# Altium schematic sheet Boris_IO_5.SchDoc: Boris IO
size A4; Date: 2017.12.10; DrawnBy: Miklós Árpád; Revision: 1.0; SheetNumber: 5; SheetTotal: 5; PageSetup: Record=PageOptions|CenterHorizontal=True|CenterVertical=True|PrintScale=1.00|XCorrection=1.00|YCorrection=1.00|PrintKind=0|BorderSize=5000000|LeftOffset=0|BottomOffset=0|Orientation=2|PaperLength=1000|PaperWidth=1000|Scale=100|PaperSource=7|PrintQuality=-4|MediaType=1|DitherType=10|PaperKind=A4|PrintScaleMode=0
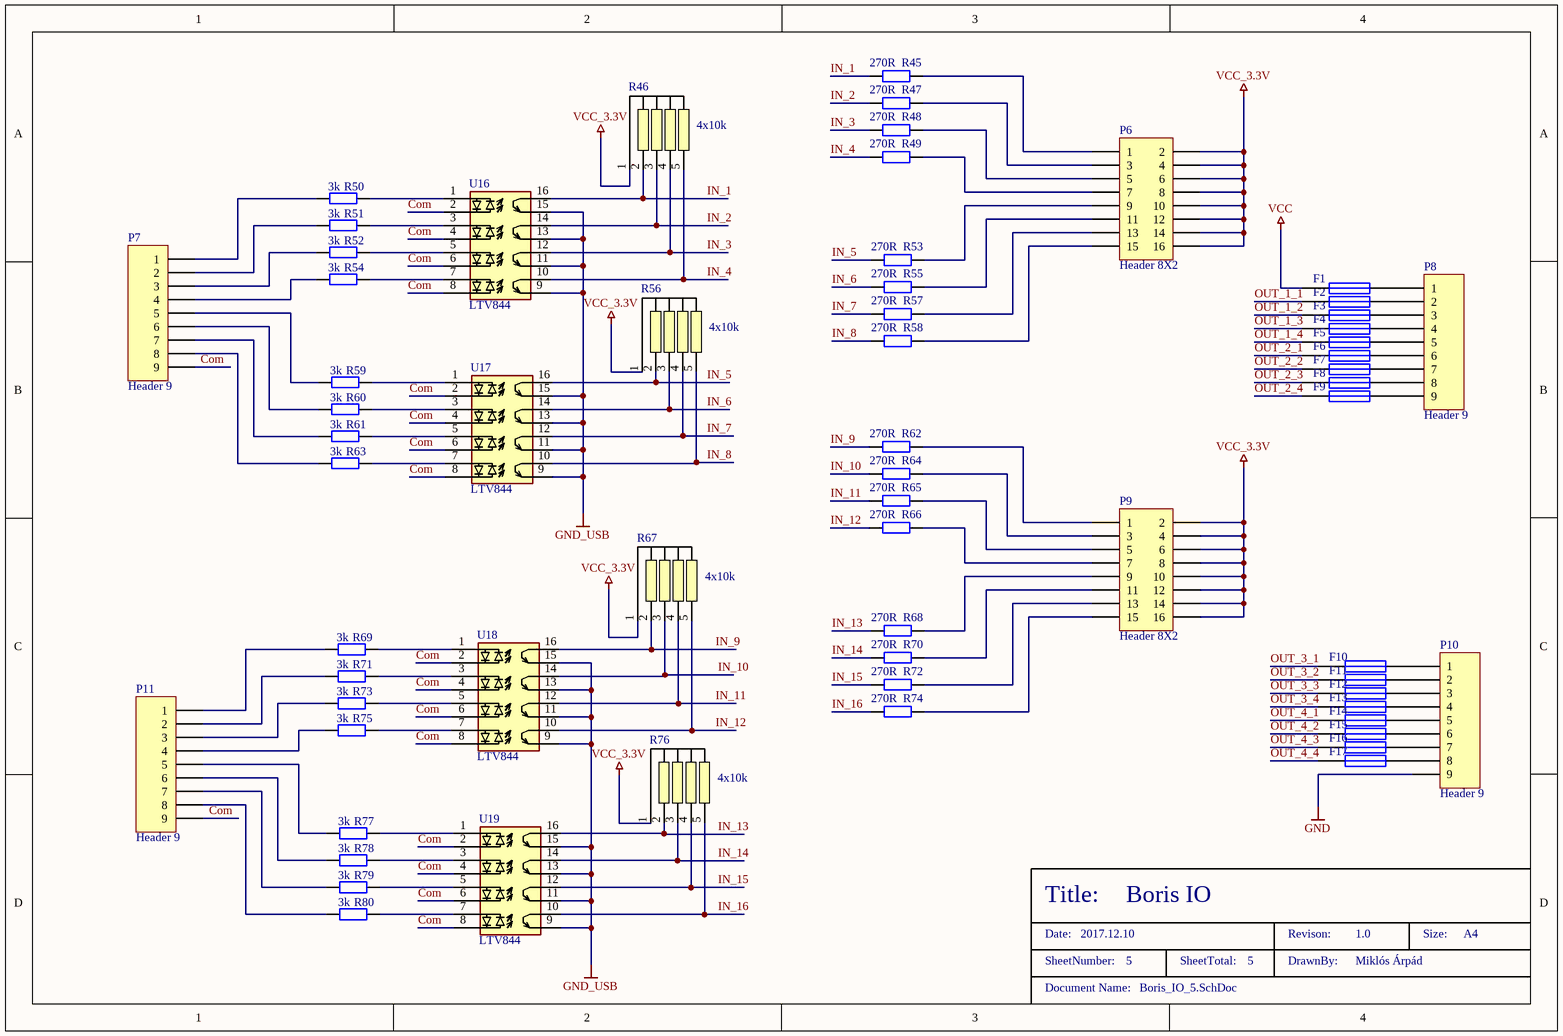
[diagram p0: Boris_IO_5.SchDoc]

## Parts
F1  SSQ 0.25A  [SST6032]  (value not drawn)
F2  SSQ 0.25A  [SST6032]  (value not drawn)
F3  SSQ 0.25A  [SST6032]  (value not drawn)
F4  SSQ 0.25A  [SST6032]  (value not drawn)
F5  SSQ 0.25A  [SST6032]  (value not drawn)
F6  SSQ 0.25A  [SST6032]  (value not drawn)
F7  SSQ 0.25A  [SST6032]  (value not drawn)
F8  SSQ 0.25A  [SST6032]  (value not drawn)
F9  SSQ 0.25A  [SST6032]  (value not drawn)
F10  SSQ 0.25A  [SST6032]  (value not drawn)
F11  SSQ 0.25A  [SST6032]  (value not drawn)
F12  SSQ 0.25A  [SST6032]  (value not drawn)
F13  SSQ 0.25A  [SST6032]  (value not drawn)
F14  SSQ 0.25A  [SST6032]  (value not drawn)
F15  SSQ 0.25A  [SST6032]  (value not drawn)
F16  SSQ 0.25A  [SST6032]  (value not drawn)
F17  SSQ 0.25A  [SST6032]  (value not drawn)
P6  Header 8X2  [HDR2X8]
P7  Header 9  [3x3]
P8  Header 9  [3x3]
P9  Header 8X2  [HDR2X8]
P10  Header 9  [3x3]
P11  Header 9  [3x3]
R45  270R  [0805_RES]
R46  4x10k  [NFD_SIL-RES-5]
R47  270R  [0805_RES]
R48  270R  [0805_RES]
R49  270R  [0805_RES]
R50  3k  [RESC3216N]
R51  3k  [RESC3216N]
R52  3k  [RESC3216N]
R53  270R  [0805_RES]
R54  3k  [RESC3216N]
R55  270R  [0805_RES]
R56  4x10k  [NFD_SIL-RES-5]
R57  270R  [0805_RES]
R58  270R  [0805_RES]
R59  3k  [RESC3216N]
R60  3k  [RESC3216N]
R61  3k  [RESC3216N]
R62  270R  [0805_RES]
R63  3k  [RESC3216N]
R64  270R  [0805_RES]
R65  270R  [0805_RES]
R66  270R  [0805_RES]
R67  4x10k  [NFD_SIL-RES-5]
R68  270R  [0805_RES]
R69  3k  [RESC3216N]
R70  270R  [0805_RES]
R71  3k  [RESC3216N]
R72  270R  [0805_RES]
R73  3k  [RESC3216N]
R74  270R  [0805_RES]
R75  3k  [RESC3216N]
R76  4x10k  [NFD_SIL-RES-5]
R77  3k  [RESC3216N]
R78  3k  [RESC3216N]
R79  3k  [RESC3216N]
R80  3k  [RESC3216N]
U16  LTV844  [LTV844S]
U17  LTV844  [LTV844S]
U18  LTV844  [LTV844S]
U19  LTV844  [LTV844S]

## Nets
GND: P10.9
GND_USB: U16.9 U16.11 U16.13 U16.15 U17.9 U17.11 U17.13 U17.15 U18.9 U18.11 U18.13 U18.15 U19.9 U19.11 U19.13 U19.15
VCC: F1.1
VCC_3.3V: P6.2 P6.4 P6.6 P6.8 P6.10 P6.12 P6.14 P6.16 P9.2 P9.4 P9.6 P9.8 P9.10 P9.12 P9.14 P9.16 R46.1 R56.1 R67.1 R76.1
Com: P7.9 P11.9 U16.2 U16.4 U16.6 U16.8 U17.2 U17.4 U17.6 U17.8 U18.2 U18.4 U18.6 U18.8 U19.2 U19.4 U19.6 U19.8
IN_1: R45.1 R46.2 U16.16
IN_2: R46.3 R47.1 U16.14
IN_3: R46.4 R48.1 U16.12
IN_4: R46.5 R49.1 U16.10
IN_5: R53.1 R56.2 U17.16
IN_6: R55.1 R56.3 U17.14
IN_7: R56.4 R57.1 U17.12
IN_8: R56.5 R58.1 U17.10
IN_9: R62.1 R67.2 U18.16
IN_10: R64.1 R67.3 U18.14
IN_11: R65.1 R67.4 U18.12
IN_12: R66.1 R67.5 U18.10
IN_13: R68.1 R76.2 U19.16
IN_14: R70.1 R76.3 U19.14
IN_15: R72.1 R76.4 U19.12
IN_16: R74.1 R76.5 U19.10
OUT_1_1: F2.1
OUT_1_2: F3.1
OUT_1_3: F4.1
OUT_1_4: F5.1
OUT_2_1: F6.1
OUT_2_2: F7.1
OUT_2_3: F8.1
OUT_2_4: F9.1
OUT_3_1: F10.1
OUT_3_2: F11.1
OUT_3_3: F12.1
OUT_3_4: F13.1
OUT_4_1: F14.1
OUT_4_2: F15.1
OUT_4_3: F16.1
OUT_4_4: F17.1
NetF1_2: F1.2 P8.1
NetF2_2: F2.2 P8.2
NetF3_2: F3.2 P8.3
NetF4_2: F4.2 P8.4
NetF5_2: F5.2 P8.5
NetF6_2: F6.2 P8.6
NetF7_2: F7.2 P8.7
NetF8_2: F8.2 P8.8
NetF9_2: F9.2 P8.9
NetF10_2: F10.2 P10.1
NetF11_2: F11.2 P10.2
NetF12_2: F12.2 P10.3
NetF13_2: F13.2 P10.4
NetF14_2: F14.2 P10.5
NetF15_2: F15.2 P10.6
NetF16_2: F16.2 P10.7
NetF17_2: F17.2 P10.8
NetP6_1: P6.1 R45.2
NetP6_3: P6.3 R47.2
NetP6_5: P6.5 R48.2
NetP6_7: P6.7 R49.2
NetP6_9: P6.9 R53.2
NetP6_11: P6.11 R55.2
NetP6_13: P6.13 R57.2
NetP6_15: P6.15 R58.2
NetP7_1: P7.1 R50.1
NetP7_2: P7.2 R51.1
NetP7_3: P7.3 R52.1
NetP7_4: P7.4 R54.1
NetP7_5: P7.5 R59.1
NetP7_6: P7.6 R60.1
NetP7_7: P7.7 R61.1
NetP7_8: P7.8 R63.1
NetP9_1: P9.1 R62.2
NetP9_3: P9.3 R64.2
NetP9_5: P9.5 R65.2
NetP9_7: P9.7 R66.2
NetP9_9: P9.9 R68.2
NetP9_11: P9.11 R70.2
NetP9_13: P9.13 R72.2
NetP9_15: P9.15 R74.2
NetP11_1: P11.1 R69.1
NetP11_2: P11.2 R71.1
NetP11_3: P11.3 R73.1
NetP11_4: P11.4 R75.1
NetP11_5: P11.5 R77.1
NetP11_6: P11.6 R78.1
NetP11_7: P11.7 R79.1
NetP11_8: P11.8 R80.1
NetR50_2: R50.2 U16.1
NetR51_2: R51.2 U16.3
NetR52_2: R52.2 U16.5
NetR54_2: R54.2 U16.7
NetR59_2: R59.2 U17.1
NetR60_2: R60.2 U17.3
NetR61_2: R61.2 U17.5
NetR63_2: R63.2 U17.7
NetR69_2: R69.2 U18.1
NetR71_2: R71.2 U18.3
NetR73_2: R73.2 U18.5
NetR75_2: R75.2 U18.7
NetR77_2: R77.2 U19.1
NetR78_2: R78.2 U19.3
NetR79_2: R79.2 U19.5
NetR80_2: R80.2 U19.7

## Notes on the sheet
- Title:
- Date:
- SheetNumber:
- Document Name:
- SheetTotal:
- Revison:
- DrawnBy:
- Size:
- A4

## Library data of the parts
F1-F17 = Fuse 1: Fuse; Published: 8-Jun-2000; LatestRevisionDate: 17-Jul-2002; LatestRevisionNote: Re-released for DXP Platform.; PackageReference: PIN-W2/E2.8; Publisher: Altium Limited; PackageDescription: Thru-Hole; 2 Leads; RET: 54-02-04
P6 P9 = Header 8X2: Header, 8-Pin, Dual row; LatestRevisionDate: 17-Jul-2002; LatestRevisionNote: Re-released for DXP Platform.; Publisher: Altium Limited
P7 P8 P10 P11 = Header 9: Header, 9-Pin; LatestRevisionDate: 17-Jul-2002; LatestRevisionNote: Re-released for DXP Platform.; Publisher: Altium Limited
R45 R47-R55 R57-R66 R68-R75 R77-R80 = Res2: Resistor; Distributor: RET
  R45 R47-R49 R53 R55 R57 R58 R62 R64-R66 R68 R70 R72 R74: Value: 270R; Catalog Number: 92-00-31; Name: 270R
  R50-R52 R54 R59-R61 R63 R69 R71 R73 R75 R77-R80: Value: 3k; Catalog Number: 92-01-33; Name: 3k
R46 R56 R67 R76 = SIL_10k: RET: *
U16-U19 = LTV844: 4x optocoupler